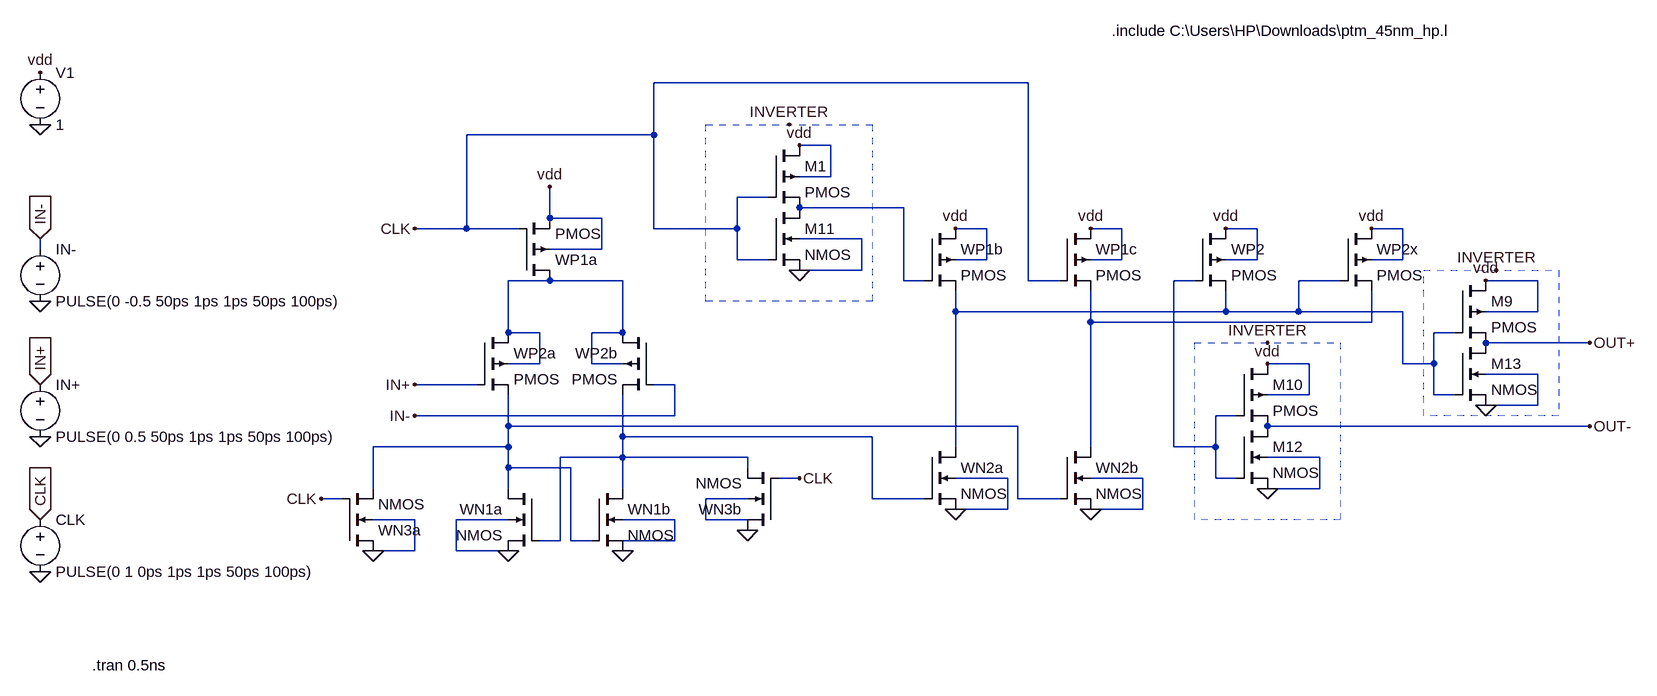
[diagram p0: schematic LSA_adder.asc]
LSA_adder.asc, the LTspice schematic file:
Version 4
SHEET 1 1348 720
WIRE 400 -192 -176 -192
WIRE -176 -112 -176 -192
WIRE -176 -112 -464 -112
WIRE 96 -96 48 -96
WIRE 96 -48 96 -96
WIRE 96 -48 48 -48
WIRE 0 -16 -48 -16
WIRE 208 0 48 0
WIRE -336 16 -336 -32
WIRE -256 16 -336 16
WIRE -464 32 -464 -112
WIRE -464 32 -544 32
WIRE -384 32 -464 32
WIRE -176 32 -176 -112
WIRE -48 32 -48 -16
WIRE -48 32 -176 32
WIRE 336 32 288 32
WIRE 544 32 496 32
WIRE 752 32 704 32
WIRE 976 32 928 32
WIRE 144 48 48 48
WIRE -1120 64 -1120 48
WIRE -256 64 -256 16
WIRE -256 64 -336 64
WIRE -48 80 -48 32
WIRE 0 80 -48 80
WIRE 336 80 336 32
WIRE 336 80 288 80
WIRE 544 80 544 32
WIRE 544 80 496 80
WIRE 752 80 752 32
WIRE 752 80 704 80
WIRE 976 80 976 32
WIRE 976 80 928 80
WIRE 144 96 144 48
WIRE 144 96 48 96
WIRE -336 112 -400 112
WIRE -224 112 -336 112
WIRE 208 112 208 0
WIRE 240 112 208 112
WIRE 400 112 400 -192
WIRE 448 112 400 112
WIRE 656 112 624 112
WIRE 880 112 816 112
WIRE 1184 112 1104 112
WIRE 288 160 288 128
WIRE 704 160 704 128
WIRE 704 160 288 160
WIRE 816 160 816 112
WIRE 816 160 704 160
WIRE 976 160 816 160
WIRE 1184 160 1184 112
WIRE 1184 160 1104 160
WIRE 496 176 496 128
WIRE 928 176 928 128
WIRE 928 176 496 176
WIRE -400 192 -400 112
WIRE -352 192 -400 192
WIRE -224 192 -224 112
WIRE -224 192 -272 192
WIRE 1056 192 1024 192
WIRE 1264 208 1104 208
WIRE -352 240 -352 192
WIRE -352 240 -400 240
WIRE -272 240 -272 192
WIRE -224 240 -272 240
WIRE 832 240 768 240
WIRE 976 240 976 160
WIRE 1024 240 1024 192
WIRE 1024 240 976 240
WIRE 1184 256 1104 256
WIRE -448 272 -544 272
WIRE -144 272 -176 272
WIRE 832 288 832 240
WIRE 832 288 768 288
WIRE 1024 288 1024 240
WIRE 1056 288 1024 288
WIRE 1184 304 1184 256
WIRE 1184 304 1104 304
WIRE -144 320 -144 272
WIRE -144 320 -544 320
WIRE 720 320 688 320
WIRE -400 336 -400 288
WIRE 384 336 -400 336
WIRE 1264 336 768 336
WIRE -224 352 -224 288
WIRE 160 352 -224 352
WIRE -400 368 -400 336
WIRE -400 368 -608 368
WIRE 288 368 288 160
WIRE 496 368 496 176
WIRE 624 368 624 112
WIRE 688 368 688 320
WIRE 688 368 624 368
WIRE -224 384 -224 352
WIRE -224 384 -320 384
WIRE -32 384 -224 384
WIRE 848 384 768 384
WIRE -400 400 -400 368
WIRE -304 400 -400 400
WIRE -32 400 -32 384
WIRE 48 416 16 416
WIRE 368 416 288 416
WIRE 576 416 496 416
WIRE 688 416 688 368
WIRE 720 416 688 416
WIRE -608 432 -608 368
WIRE -400 432 -400 400
WIRE -224 432 -224 384
WIRE 848 432 848 384
WIRE 848 432 768 432
WIRE -656 448 -688 448
WIRE -32 448 -96 448
WIRE 160 448 160 352
WIRE 240 448 160 448
WIRE 384 448 384 336
WIRE 448 448 384 448
WIRE 368 464 368 416
WIRE 368 464 288 464
WIRE 576 464 576 416
WIRE 576 464 496 464
WIRE -544 480 -608 480
WIRE -400 480 -480 480
WIRE -144 480 -224 480
WIRE -96 480 -96 448
WIRE -32 480 -96 480
WIRE -32 496 -32 480
WIRE -320 512 -320 384
WIRE -320 512 -352 512
WIRE -304 512 -304 400
WIRE -272 512 -304 512
WIRE -144 512 -144 480
WIRE -144 512 -224 512
WIRE -544 528 -544 480
WIRE -544 528 -608 528
WIRE -480 528 -480 480
WIRE -400 528 -480 528
WIRE -224 528 -224 512
FLAG -336 -32 vdd
FLAG 48 -96 vdd
FLAG 288 32 vdd
FLAG 496 32 vdd
FLAG 704 32 vdd
FLAG 928 32 vdd
FLAG 1104 112 vdd
FLAG 768 240 vdd
FLAG -608 528 0
FLAG -400 528 0
FLAG -224 528 0
FLAG 288 464 0
FLAG 496 464 0
FLAG 768 432 0
FLAG 1104 304 0
FLAG 48 96 0
FLAG -32 496 0
FLAG 48 416 CLK
FLAG -688 448 CLK
FLAG -544 32 CLK
FLAG -544 272 IN+
FLAG -544 320 IN-
FLAG 1264 208 OUT+
FLAG 1264 336 OUT-
FLAG 768 208 INVERTER
FLAG 1120 96 INVERTER
FLAG 32 -128 INVERTER
FLAG -1120 352 0
FLAG -1120 560 0
FLAG -1120 144 0
FLAG -1120 48 IN-
IOPIN -1120 48 In
FLAG -1120 272 IN+
IOPIN -1120 272 In
FLAG -1120 480 CLK
IOPIN -1120 480 In
FLAG -1120 -128 0
FLAG -1120 -208 vdd
SYMBOL pmos4 0 -96 R0
SYMATTR InstName M1
SYMATTR Value2 l=45nm w=180nm
SYMBOL pmos4 240 32 R0
SYMATTR InstName WP1b
SYMATTR Value2 l=45nm w=1350nm
SYMBOL pmos4 448 32 R0
SYMATTR InstName WP1c
SYMATTR Value2 l=45nm w=1350nm
SYMBOL pmos4 656 32 R0
SYMATTR InstName WP2
SYMATTR Value2 l=45nm w=270nm
SYMBOL pmos4 -384 112 M180
SYMATTR InstName WP1a
SYMATTR Value2 l=45nm w=1350nm
SYMBOL pmos4 -448 192 R0
SYMATTR InstName WP2a
SYMATTR Value2 l=45nm w=270nm
SYMBOL pmos4 -176 192 M0
SYMATTR InstName WP2b
SYMATTR Value2 l=45nm w=270nm
SYMBOL pmos4 880 32 R0
SYMATTR InstName WP2x
SYMATTR Value2 l=45nm w=270nm
SYMBOL pmos4 1056 112 R0
SYMATTR InstName M9
SYMATTR Value2 l=45nm w=180nm
SYMBOL pmos4 720 240 R0
SYMATTR InstName M10
SYMATTR Value2 l=45nm w=180nm
SYMBOL nmos4 0 0 R0
SYMATTR InstName M11
SYMATTR Value2 l=45nm w=90nm
SYMBOL nmos4 720 336 R0
SYMATTR InstName M12
SYMATTR Value2 l=45nm w=90nm
SYMBOL nmos4 1056 208 R0
SYMATTR InstName M13
SYMATTR Value2 l=45nm w=90nm
SYMBOL nmos4 -656 528 M180
SYMATTR InstName WN3a
SYMATTR Value2 l=45nm w=90nm
SYMBOL nmos4 -352 432 M0
SYMATTR InstName WN1a
SYMATTR Value2 l=45nm w=270nm
SYMBOL nmos4 -272 432 R0
SYMATTR InstName WN1b
SYMATTR Value2 l=45nm w=270nm
SYMBOL nmos4 240 368 R0
SYMATTR InstName WN2a
SYMATTR Value2 l=45nm w=270nm
SYMBOL nmos4 448 368 R0
SYMATTR InstName WN2b
SYMATTR Value2 l=45nm w=270nm
SYMBOL nmos4 16 496 R180
SYMATTR InstName WN3b
SYMATTR Value2 l=45nm w=90nm
SYMBOL voltage -1120 48 R0
WINDOW 123 0 0 Left 0
WINDOW 39 0 0 Left 0
SYMATTR InstName IN-
SYMATTR Value PULSE(0 -0.5 50ps 1ps 1ps 50ps 100ps)
SYMBOL voltage -1120 256 R0
WINDOW 123 0 0 Left 0
WINDOW 39 0 0 Left 0
SYMATTR InstName IN+
SYMATTR Value PULSE(0 0.5 50ps 1ps 1ps 50ps 100ps)
SYMBOL voltage -1120 464 R0
WINDOW 123 0 0 Left 0
WINDOW 39 0 0 Left 0
SYMATTR InstName CLK
SYMATTR Value PULSE(0 1 0ps 1ps 1ps 50ps 100ps)
SYMBOL voltage -1120 -224 R0
WINDOW 123 0 0 Left 0
WINDOW 39 0 0 Left 0
SYMATTR InstName V1
SYMATTR Value 1
TEXT 528 -272 Left 2 !.include C:\\Users\\HP\\Downloads\\ptm_45nm_hp.l
TEXT -1040 704 Left 2 !.tran 0.5ns
RECTANGLE Normal 160 144 -96 -128 2
RECTANGLE Normal 880 480 656 208 2
RECTANGLE Normal 1216 320 1008 96 2

The netlist it stands for:
* LSA_adder.asc
M1 vdd CLK N001 vdd PMOS l=45nm w=180nm
M§WP1b vdd N001 N004 vdd PMOS l=45nm w=1350nm
M§WP1c vdd CLK N005 vdd PMOS l=45nm w=1350nm
M§WP2 vdd N003 N004 vdd PMOS l=45nm w=270nm
M§WP1a N002 CLK vdd vdd PMOS l=45nm w=1350nm
M§WP2a N002 IN+ N006 N002 PMOS l=45nm w=270nm
M§WP2b N002 IN- N007 N002 PMOS l=45nm w=270nm
M§WP2x vdd N004 N005 vdd PMOS l=45nm w=270nm
M9 vdd N004 OUT+ vdd PMOS l=45nm w=180nm
M10 vdd N003 OUT- vdd PMOS l=45nm w=180nm
M11 N001 CLK 0 0 NMOS l=45nm w=90nm
M12 OUT- N003 0 0 NMOS l=45nm w=90nm
M13 OUT+ N004 0 0 NMOS l=45nm w=90nm
M§WN3a 0 CLK N006 0 NMOS l=45nm w=90nm
M§WN1a N006 N007 0 0 NMOS l=45nm w=270nm
M§WN1b N007 N006 0 0 NMOS l=45nm w=270nm
M§WN2a N004 N007 0 0 NMOS l=45nm w=270nm
M§WN2b N005 N006 0 0 NMOS l=45nm w=270nm
M§WN3b 0 CLK N007 0 NMOS l=45nm w=90nm
V§IN- IN- 0 PULSE(0 -0.5 50ps 1ps 1ps 50ps 100ps)
V§IN+ IN+ 0 PULSE(0 0.5 50ps 1ps 1ps 50ps 100ps)
V§CLK CLK 0 PULSE(0 1 0ps 1ps 1ps 50ps 100ps)
V1 vdd 0 1
.model NMOS NMOS
.model PMOS PMOS
.lib standard.mos
.include C:\Users\HP\Downloads\ptm_45nm_hp.l
.tran 0.5ns
.backanno
.end